# Altium schematic sheet MCU063A_Support.SchDoc
size 431 x 279 mm; Date: Not shown in title block; ApprovedBy: Not shown in title block; CheckedBy: Not shown in title block; Author: Not shown in title block; CompanyName: Not shown in title block; DrawnBy: Cody Watkins; Engineer: Not shown in title block; Organization: Not shown in title block; Address1: Not shown in title block; Address2: Not shown in title block; Address3: Not shown in title block; Address4: Not shown in title block; DocumentNumber: 3; Revision: Use project parameter SCH_Rev; SheetNumber: 3; SheetTotal: 11; PageSetup: Record=PageOptions|CenterHorizontal=True|CenterVertical=True|PrintScale=1.00|XCorrection=1.00|YCorrection=1.00|PrintKind=0|BorderSize=5000000|LeftOffset=0|BottomOffset=0|Orientation=2|PaperLength=1000|PaperWidth=1000|Scale=100|PaperSource=15|PrintQuality=600|MediaType=1|DitherType=10|PaperKind=Letter|PrintScaleMode=1; CurrentTime: Not shown in title block; CurrentDate: Not shown in title block; Time: Not shown in title block; DocumentFullPathAndName: Not shown in title block; DocumentName: Not shown in title block; ModifiedDate: Not shown in title block; ImagePath: Not shown in title block
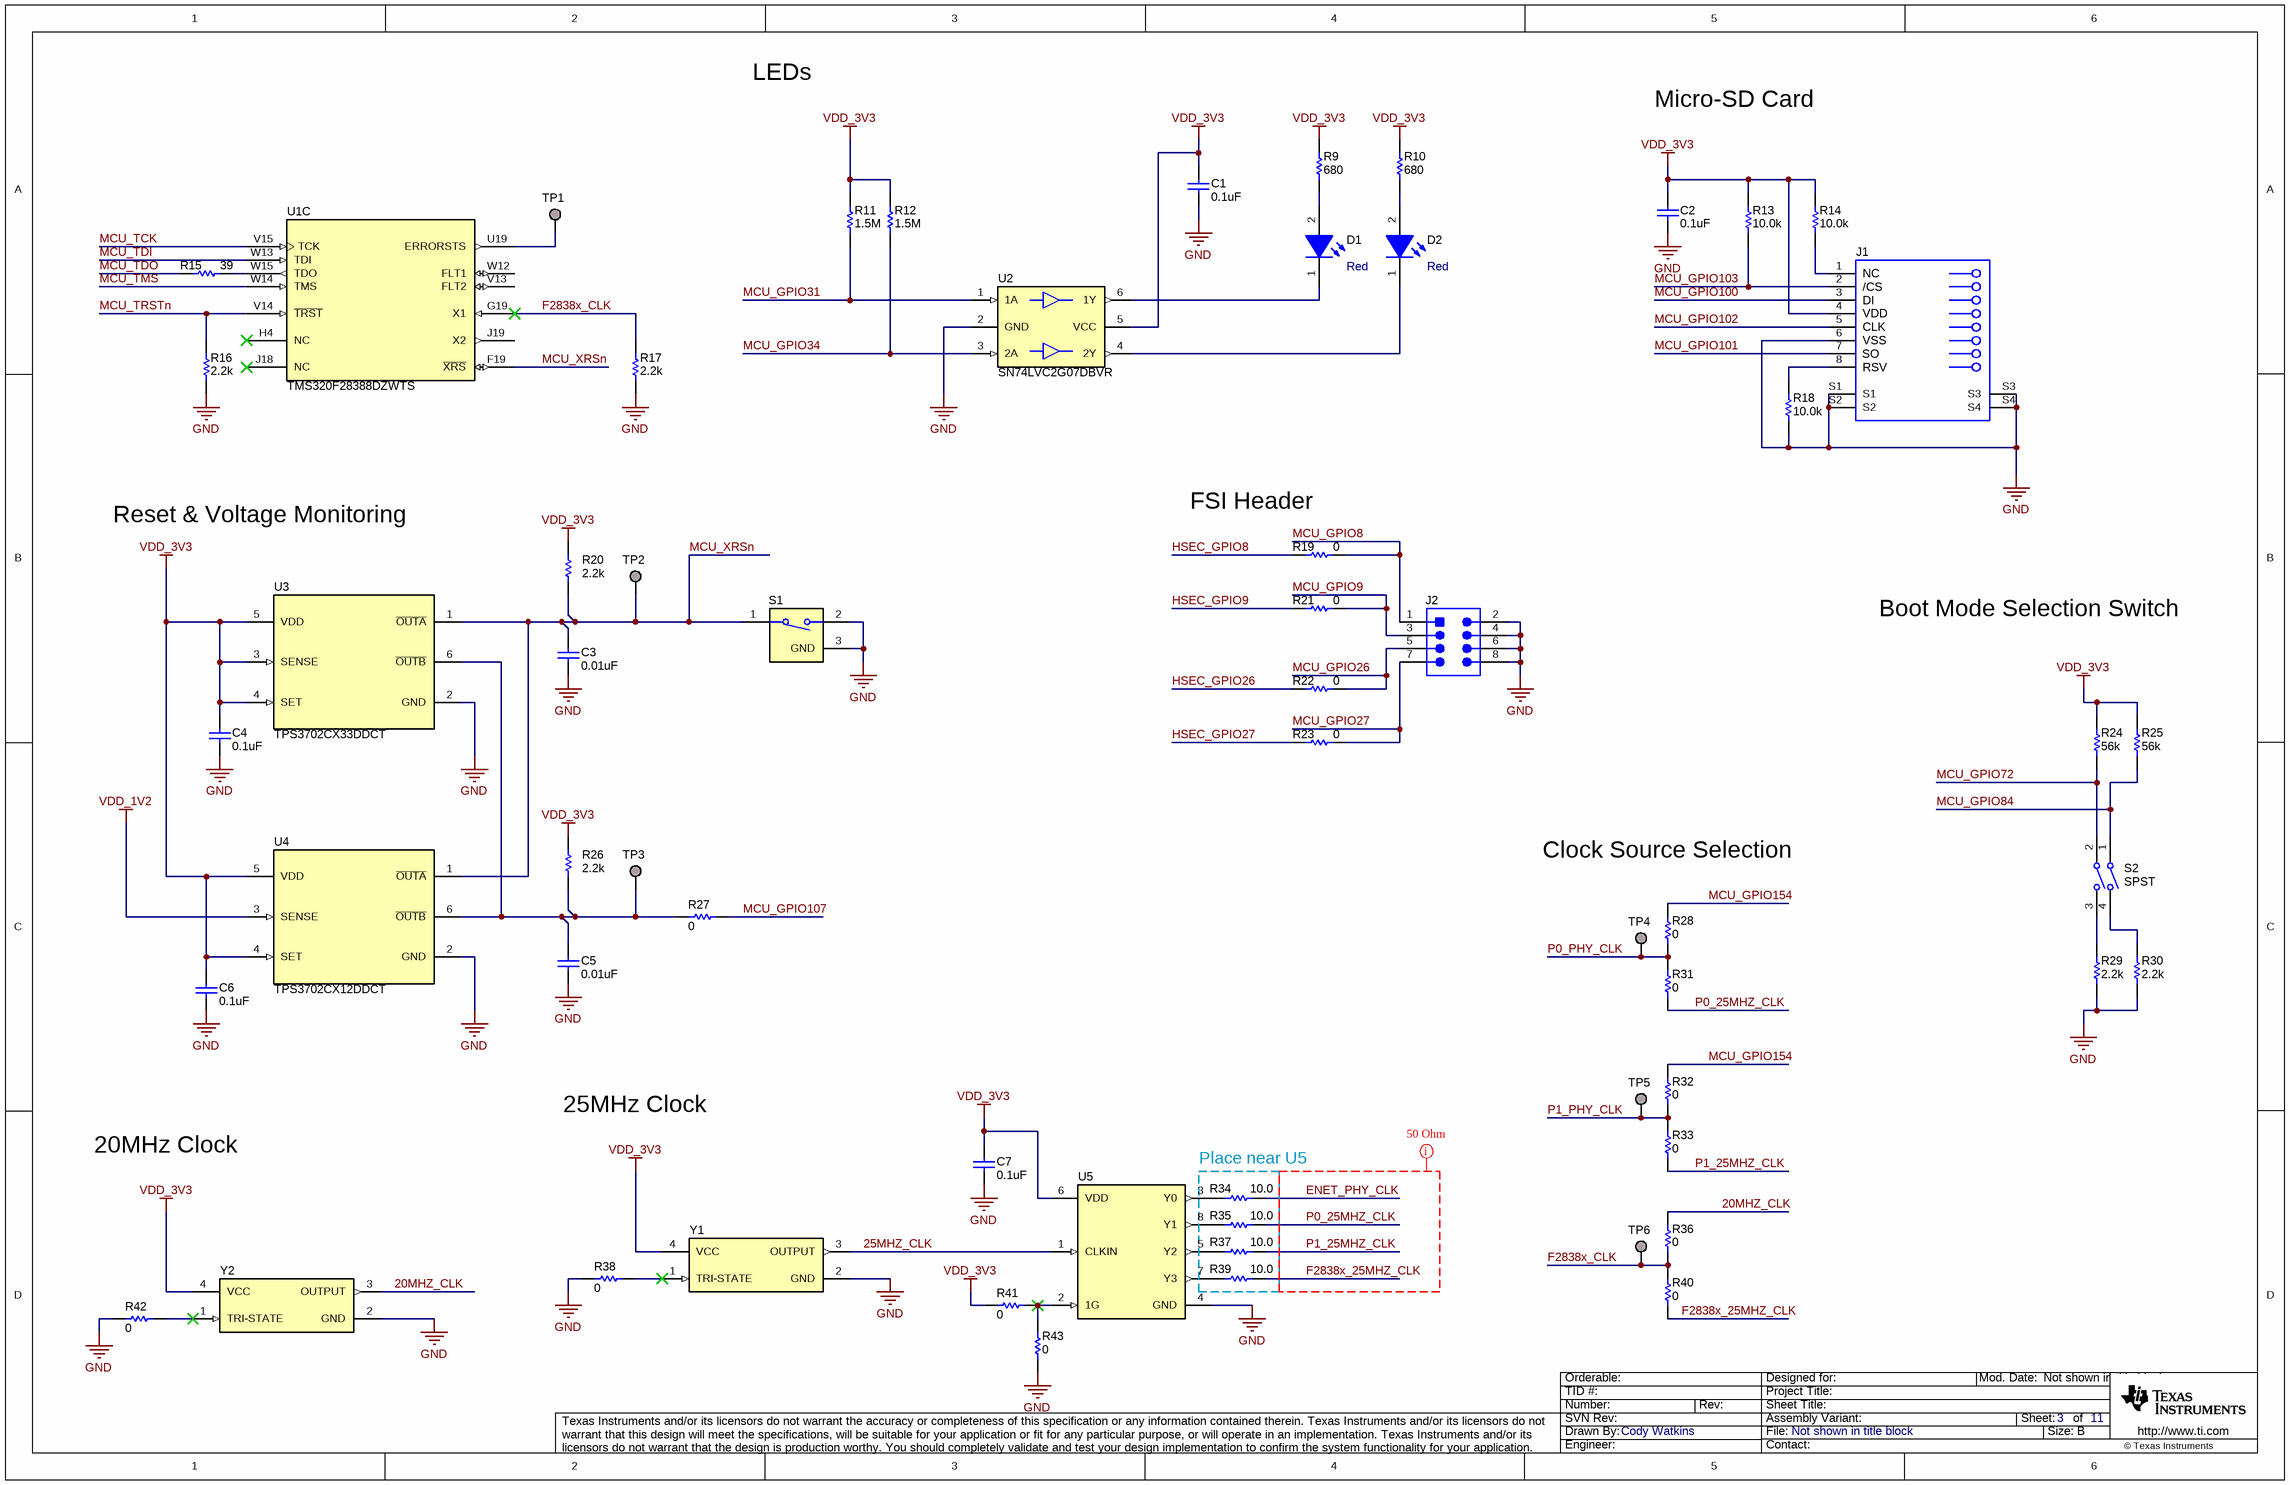
[diagram p0: MCU063A_Support.SchDoc]

## Parts
C1  ValueDisplayed: 0.1uF  [0402]  (hidden comment: CL05B104KP5NNNC)
C2  ValueDisplayed: 0.1uF  [0402]  (hidden comment: CL05B104KP5NNNC)
C3  ValueDisplayed: 0.01uF  [0402]  (hidden comment: C0402C103J5RACTU)
C4  ValueDisplayed: 0.1uF  [0402]  (hidden comment: CL05B104KP5NNNC)
C5  ValueDisplayed: 0.01uF  [0402]  (hidden comment: C0402C103J5RACTU)
C6  ValueDisplayed: 0.1uF  [0402]  (hidden comment: CL05B104KP5NNNC)
C7  ValueDisplayed: 0.1uF  [0402]  (hidden comment: CL05B104KP5NNNC)
D1  value Red  [WL-SMCW_RED_0805]  (hidden comment: 150080SS75000)
D2  value Red  [WL-SMCW_RED_0805]  (hidden comment: 150080SS75000)
J1  2908-05WB-MG  [3M_2908-05WB-MG]  (value not drawn)
J2  TMM-104-01-T-D  [Samtec_TMM-104-01-x-D]  (value not drawn)
R9  ValueDisplayed: 680  [0402]  (hidden comment: CRCW0402680RJNED)
R10  ValueDisplayed: 680  [0402]  (hidden comment: CRCW0402680RJNED)
R11  ValueDisplayed: 1.5M  [0402]  (hidden comment: CRCW04021M50JNED)
R12  ValueDisplayed: 1.5M  [0402]  (hidden comment: CRCW04021M50JNED)
R13  ValueDisplayed: 10.0k  [0402]  (hidden comment: RC0402FR-0710KL)
R14  ValueDisplayed: 10.0k  [0402]  (hidden comment: RC0402FR-0710KL)
R15  ValueDisplayed: 39  [0402]  (hidden comment: CRCW040239R0JNED)
R16  ValueDisplayed: 2.2k  [0402]  (hidden comment: CRCW04022K20JNED)
R17  ValueDisplayed: 2.2k  [0402]  (hidden comment: CRCW04022K20JNED)
R18  ValueDisplayed: 10.0k  [0402]  (hidden comment: RC0402FR-0710KL)
R19  ValueDisplayed: 0  [0603]  (hidden comment: CRCW06030000Z0EA)
R20  ValueDisplayed: 2.2k  [0402]  (hidden comment: CRCW04022K20JNED)
R21  ValueDisplayed: 0  [0603]  (hidden comment: CRCW06030000Z0EA)
R22  ValueDisplayed: 0  [0603]  (hidden comment: CRCW06030000Z0EA)
R23  ValueDisplayed: 0  [0603]  (hidden comment: CRCW06030000Z0EA)
R24  ValueDisplayed: 56k  [0402]  (hidden comment: CRCW040256K0JNED)
R25  ValueDisplayed: 56k  [0402]  (hidden comment: CRCW040256K0JNED)
R26  ValueDisplayed: 2.2k  [0402]  (hidden comment: CRCW04022K20JNED)
R27  ValueDisplayed: 0  [0603]  (hidden comment: CRCW06030000Z0EA)
R28  ValueDisplayed: 0  [0603]  (hidden comment: CRCW06030000Z0EA)
R29  ValueDisplayed: 2.2k  [0402]  (hidden comment: CRCW04022K20JNED)
R30  ValueDisplayed: 2.2k  [0402]  (hidden comment: CRCW04022K20JNED)
R31  ValueDisplayed: 0  [0603]  (hidden comment: CRCW06030000Z0EA)
R32  ValueDisplayed: 0  [0603]  (hidden comment: CRCW06030000Z0EA)
R33  ValueDisplayed: 0  [0603]  (hidden comment: CRCW06030000Z0EA)
R34  ValueDisplayed: 10.0  [CPF0402]  (hidden comment: CPF0402B10RE1)
R35  ValueDisplayed: 10.0  [CPF0402]  (hidden comment: CPF0402B10RE1)
R36  ValueDisplayed: 0  [0603]  (hidden comment: CRCW06030000Z0EA)
R37  ValueDisplayed: 10.0  [CPF0402]  (hidden comment: CPF0402B10RE1)
R38  ValueDisplayed: 0  [0402]  (hidden comment: CRCW04020000Z0EDHP)
R39  ValueDisplayed: 10.0  [CPF0402]  (hidden comment: CPF0402B10RE1)
R40  ValueDisplayed: 0  [0603]  (hidden comment: CRCW06030000Z0EA)
R41  ValueDisplayed: 0  [0402]  (hidden comment: CRCW04020000Z0EDHP)
R42  ValueDisplayed: 0  [0402]  (hidden comment: CRCW04020000Z0EDHP)
R43  ValueDisplayed: 0  [0402]  (hidden comment: CRCW04020000Z0EDHP)
S1  B3U-1100P  [SW_B3U-1100P]  (value not drawn)
S2  Circuit: SPST  [SW_218-2LP]  (hidden comment: 218-2LPST)
TP1  TESTPOINT  [TP_50MIL-25MILHOLE]  (value not drawn)  (no BOM)
TP2  TESTPOINT  [TP_50MIL-25MILHOLE]  (value not drawn)  (no BOM)
TP3  TESTPOINT  [TP_50MIL-25MILHOLE]  (value not drawn)  (no BOM)
TP4  TESTPOINT  [TP_50MIL-25MILHOLE]  (value not drawn)  (no BOM)
TP5  TESTPOINT  [TP_50MIL-25MILHOLE]  (value not drawn)  (no BOM)
TP6  TESTPOINT  [TP_50MIL-25MILHOLE]  (value not drawn)  (no BOM)
U1  TMS320F28388DZWTS  [ZWT0337A]  (part C of 5)
U2  SN74LVC2G07DBVR  [DBV0006A_N]
U3  TPS3702CX33DDCT  [DDC0006A_N]
U4  TPS3702CX12DDCT  [DDC0006A_N]
U5  CDCLVC1104PW  [PW0008A_N]  (value not drawn)
Y1  ECS-2520S33-250-FN-TR  [ECS_ECS-2520S]  (value not drawn)
Y2  ECS-2520S33-200-FN-TR  [ECS_ECS-2520S]  (value not drawn)

## Nets
GND: C1.2 C2.2 C3.2 C4.2 C5.2 C6.2 C7.2 J1.6(VSS) J1.S1 J1.S2 J1.S3 J1.S4 J2.2 J2.4 J2.6 J2.8 R16.1 R17.1 R18.1 R29.2 R30.1 R38.2 R42.2 R43.2 S1.2 S1.3(GND) U2.2(GND) U3.2(GND) U4.2(GND) U5.4(GND) Y1.2(GND) Y2.2(GND)
VDD_1V2: U4.3(SENSE)
VDD_3V3: C1.1 C2.1 C4.1 C6.1 C7.1 J1.4(VDD) R9.1 R10.1 R11.2 R12.2 R13.2 R14.2 R20.2 R24.1 R25.2 R26.2 R41.1 U2.5(VCC) U3.3(SENSE) U3.4(SET) U3.5(VDD) U4.4(SET) U4.5(VDD) U5.6(VDD) Y1.4(VCC) Y2.4(VCC)
20MHZ_CLK: R36.1 Y2.3(OUTPUT)
25MHZ_CLK: U5.1(CLKIN) Y1.3(OUTPUT)
ENET_PHY_CLK: R34.2
F2838x_25MHZ_CLK: R39.2 R40.2
F2838x_CLK: R17.2 R36.2 R40.1 TP6.1 U1.G19(X1)
HSEC_GPIO8: R19.2
HSEC_GPIO9: R21.2
HSEC_GPIO26: R22.2
HSEC_GPIO27: R23.2
MCU_GPIO8: J2.1 R19.1
MCU_GPIO9: J2.3 R21.1
MCU_GPIO26: J2.5 R22.1
MCU_GPIO27: J2.7 R23.1
MCU_GPIO31: R11.1 U2.1(1A)
MCU_GPIO34: R12.1 U2.3(2A)
MCU_GPIO72: R24.2 S2.2
MCU_GPIO84: R25.1 S2.1
MCU_GPIO100: J1.3(CMD)
MCU_GPIO101: J1.7(DAT0)
MCU_GPIO102: J1.5(CLK)
MCU_GPIO103: J1.2(CD/DAT3) R13.1
MCU_GPIO107: R27.2
MCU_GPIO154: R28.1 R32.1
MCU_TCK: U1.V15(TCK)
MCU_TDI: U1.W13(TDI)
MCU_TDO: R15.1
MCU_TMS: U1.W14(TMS)
MCU_TRSTn: R16.2 U1.V14(~{TRST})
MCU_XRSn: C3.1 R20.1 S1.1 TP2.1 U1.F19(~{XRS}) U3.1(~{OUTA}) U4.1(~{OUTA})
P0_25MHZ_CLK: R31.2 R35.2
P0_PHY_CLK: R28.2 R31.1 TP4.1
P1_25MHZ_CLK: R33.2 R37.2
P1_PHY_CLK: R32.2 R33.1 TP5.1
NetC5_1: C5.1 R26.1 R27.1 TP3.1 U3.6(~{OUTB}) U4.6(~{OUTB})
NetD1_1: D1.1(K) U2.6(1Y)
NetD1_2: D1.2(A) R9.2
NetD2_1: D2.1(K) U2.4(2Y)
NetD2_2: D2.2(A) R10.2
NetJ1_1: J1.1(DAT2) R14.1
NetJ1_8: J1.8(DAT1) R18.2
NetR15_2: R15.2 U1.W15(TDO)
NetR29_1: R29.1 S2.3
NetR30_2: R30.2 S2.4
NetR34_1: R34.1 U5.3(Y0)
NetR35_1: R35.1 U5.8(Y1)
NetR37_1: R37.1 U5.5(Y2)
NetR38_1: R38.1 Y1.1(TRI-STATE)
NetR39_1: R39.1 U5.7(Y3)
NetR41_2: R41.2 R43.1 U5.2(1G)
NetR42_1: R42.1 Y2.1(TRI-STATE)
NetTP1_1: TP1.1 U1.U19(ERRORSTS)

Not connected (* = marked no-connect by the designer): U1 H4(NC)* J18(NC)* J19(X2) V13(FLT2) W12(FLT1)

## Layout directives
50 Ohm Impedance: Undefined: ENET_PHY_CLK, F2838x_25MHZ_CLK, P0_25MHZ_CLK, P1_25MHZ_CLK

## Notes on the sheet
- LEDs
- Micro-SD Card
- (near R19) FSI Header
- Reset & Voltage Monitoring
- Boot Mode Selection Switch
- Clock Source Selection
- 25MHz Clock
- 20MHz Clock
- Place near U5
- Drawn By:
- SVN Rev:
- Number:
- TID #:
- Orderable:
- Rev:
- Sheet Title:
- File:
- Project Title:
- Designed for:
- Assembly Variant:
- Mod. Date:
- Sheet:
- Size:
- of
- B
- http://www.ti.com
- Texas Instruments and/or its licensors do not warrant the accuracy or completeness of this specification or any information contained therein. Texas Instruments and/or its licensors do not warrant that this design will meet the specifications, will be suitable for your application or fit for any particular purpose, or will operate in an implementation. Texas Instruments and/or its licensors do not warrant that the design is production worthy. You should completely validate and test your design implementation to confirm the system functionality for your application.
- Engineer:
- Contact:
- © Texas Instruments
- (in symbol CMP-0075148-2) NC; /CS; DI; SO; RSV

## Library data of the parts
C1 C2 C4 C6 C7 = CMP-0006343-2: CAP, CERM, 0.1 uF, 10 V, +/- 10%, X7R, 0402; Manufacturer: Samsung Electro-Mechanics; Polarized: N; Value: 0.1uF; U/M: EA; Cap_F: 100nF; Value1: Unknown; VDC_V: 10V; TaMin_C: -55°C; TaMax_C: 125°C; AEC Category: Q200; SizeArea_mm2: 0.5; SizeAreaWB_mm2: 3; SizeX_mm: 1; SizeZ_mm: 0.6; CompType: Capacitor; PartNumber: CL05B104KP5NNNC; PackageReference: 0402; RoHS: Y; Tolerance_%: 10%; Value2: 10V; MountType: SMT; Technology: Ceramic; TempCo: X7R; Cap_Case: 0402; Published: 2008-06-19; Publisher: Texas Instruments; LatestRevisionDate: 2017-03-09; ComponentLink1Description: Datasheet link; ComponentLink1URL: http://www.samsungsem.com/kr/front/downloadcms.do?path=/kr/support/product-search/mlcc/__icsFiles/afieldfile/2014/11/05&fileName=S_CL05B104KP5NNNC.pdf; AEC Qualified: N; AEC Grade: N/A; SizeY_mm: 0.5
C3 C5 = CMP-0006236-2: CAP, CERM, 0.01 uF, 50 V, +/- 5%, X7R, 0402; Manufacturer: Kemet; TaMin_C: -55°C; Polarized: N; SizeAreaWB_mm2: 3; Value1: Unknown; U/M: EA; Value: 0.01uF; TaMax_C: 125°C; SizeZ_mm: 0.6; SizeX_mm: 1; SizeY_mm: 0.5; Value2: 50V; Cap_F: 10nF; AEC Category: Q200; Supplier Part Number 2: 57J0044; Publisher: Texas Instruments; Supplier 2: Newark; Supplier Part Number 3: 80-C0402C103J5R; TempCo: X7R; Supplier 3: Mouser; Published: 2008-06-19; RoHS: Y; MountType: SMT; Supplier 1: Digi-Key; PackageReference: 0402; Tolerance_%: 5%; Cap_Case: 0402; SizeArea_mm2: 0.5; CompType: Capacitor; LatestRevisionDate: 2017-03-09; PartNumber: C0402C103J5RACTU; AEC Qualified: ?; ComponentLink1Description: Datasheet link; Supplier Part Number 1: 399-7758-1-ND; Technology: Ceramic; ComponentLink1URL: http://www.kemet.com/Lists/ProductCatalog/Attachments/53/KEM_C1002_X7R_SMD.pdf
D1 = CMP-0002951-3: LED, Red, SMD; Manufacturer: Wurth Elektronik; Type: AlInGaP; Angle: 140; Vr_V: 5V; Ir_A: 25µA; Vf_V: 1.9V; Value1: 0.072W; Tjmax_C: 85°C; Io_A: 30mA; Power_TotalModule: 72mW; CompType: LED; PartNumber: 150080SS75000; Color: Red; MountType: SMT; ComponentLink1URL: http://katalog.we-online.de/led/datasheet/150080SS75000.pdf; PackageReference: LED_0805; ComponentLink1Description: Datasheet link; Value2: 1.9V; RoHS: Y
D2 = CMP-0002951-3: LED, Red, SMD; Manufacturer: Wurth Elektronik; Type: AlInGaP; Vf_V: 1.9V; Io_A: 30mA; Vr_V: 5V; Ir_A: 25µA; Tjmax_C: 85°C; Power_TotalModule: 72mW; Value1: 0.072W; Angle: 140; PartNumber: 150080SS75000; PackageReference: LED_0805; RoHS: Y; CompType: LED; MountType: SMT; Value2: 1.9V; Color: Red; ComponentLink1URL: http://katalog.we-online.de/led/datasheet/150080SS75000.pdf; ComponentLink1Description: Datasheet link
J1 = CMP-0075148-2: Connector, Micro SD, R/A, SMD; Manufacturer: 3M; Gender: Female; Row_Count: 1; Pitch_mm: 1.1; ContactFinish: Gold; ComponentLink1URL: http://multimedia.3m.com/mws/media/416257O/3mtm-card-connector-microsdtm-2900-series-ts2197.pdf?&a4x&cEVuQEcuZgVs6EVs6E666666--; Supplier Part Number 2: 28M0115; Supplier 2: Newark; Supplier Part Number 3: 517-2908-05WB-MG; Supplier 3: Mouser; RoHS: Y; MountType: SMT; Supplier 1: Digi-Key; PackageReference: Connector, Micro SD, R/A, SMD; PinCount: 8; CompType: Connector; PartNumber: 2908-05WB-MG; Orientation: R/A; ComponentLink1Description: Datasheet URL; Supplier Part Number 1: 3M5607CT-ND
J2 = CMP-0055568-2: Header, 2mm, 4x2, Tin, TH; Manufacturer: Samtec; Current_A: 3.2A; Shrouded: N; Gender: Male; Cert_CSA: Y; Row_Count: 2; ComponentLink1URL: http://suddendocs.samtec.com/catalog_english/tmm_th.pdf; ClassName: Header; Supplier Part Number 2: 12P0661; Supplier 2: Newark; Supplier Part Number 3: 1803386; Color: Black; Supplier 3: Farnell; RoHS: Y; MountType: TH; Supplier 1: Digi-Key; PackageReference: Header, 2mm, 4x2, TH; PinCount: 8; CompType: Header; PartNumber: TMM-104-01-T-D; Orientation: Vertical; RowSpacing_mm: 2; ComponentLink1Description: Datasheet URL; Supplier Part Number 1: SAM1177-04-ND; Pitch_mm: 2; ContactFinish: Tin; Cert_UL: Y
R9 R10 = CMP-0026962-3: RES, 680, 5%, 0.063 W, AEC-Q200 Grade 0, 0402; Manufacturer: Vishay-Dale; Value: 680; Value_Code: 680R; Power_W: 63mW; Value2: 0.063W; VDC_V: 50V; TempCo: 200 ppm/C; EIA_Code: E24; AEC Category: Q200; AEC Qualified: Y; AEC Grade: 0; SizeArea_mm2: 0.5; SizeX_mm: 1; SizeZ_mm: 0.6; CompType: Resistor; PartNumber: CRCW0402680RJNED; PackageReference: 0402; RoHS: E; Res_ohm: 680; Tolerance_%: 5%; Value1: 5%; MountType: SMT; Technology: Thick Film; ComponentLink1Description: Datasheet link; ComponentLink1URL: http://www.vishay.com/docs/20035/dcrcwe3.pdf; Supplier 1: Digi-Key; Supplier Part Number 1: 541-680JCT-ND; Supplier 2: Newark; Supplier Part Number 2: 59M6744; Supplier 3: Mouser; Supplier Part Number 3: 71-CRCW0402J-680-E3; SizeY_mm: 0.5
R11 R12 = CMP-0026863-2: RES, 1.5 M, 5%, 0.063 W, AEC-Q200 Grade 0, 0402; Manufacturer: Vishay-Dale; Power_W: 63mW; TempCo: 200 ppm/C; Value_Code: 1M50; Value: 1.5Meg; EIA_Code: E24; SizeX_mm: 1; SizeY_mm: 0.5; SizeZ_mm: 0.6; Value2: 0.063W; AEC Qualified: Y; VDC_V: 50V; AEC Category: Q200; AEC Grade: 0; ComponentLink1URL: http://www.vishay.com/docs/20035/dcrcwe3.pdf; Supplier Part Number 2: 71-CRCW04021M50JNED; Supplier 2: Mouser; RoHS: E; Value1: 5%; MountType: SMT; Supplier 1: Digi-Key; PackageReference: 0402; Tolerance_%: 5%; Res_ohm: 1.5M; SizeArea_mm2: 0.5; CompType: Resistor; PartNumber: CRCW04021M50JNED; ComponentLink1Description: Datasheet link; Supplier Part Number 1: 541-1.5MJCT-ND; Technology: Thick Film
R13 R14 R18 = CMP-0078669-1: RES, 10.0 k, 1%, 0.063 W, 0402; Manufacturer: Yageo America; Power_W: 63mW; Green_Lifecycle: Active; TempCo: 100 ppm/C; Value_Code: 10k0; Green_REACh: Passed; Value: 10.0k; EIA_Code: E96; Res_ohm: 10k; SizeX_mm: 1; SizeY_mm: 0.5; SizeZ_mm: 0.6; Value2: 0.063W; AEC Qualified: N; AEC Category: Q200; ComponentLink1URL: http://www.yageo.com/documents/recent/PYu-RC_Group_51_RoHS_L_8.pdf; Supplier Part Number 2: 98K7499; Supplier 2: Newark; Supplier Part Number 3: 603-RC0402FR-0710KL; Supplier 3: Mouser; RoHS: Y; Value1: 1%; MountType: SMT; Green_EU RoHS-2: Passed; Supplier 1: Digi-Key; Green_EU RoHS: Passed with Exemption; PackageReference: 0402; Tolerance_%: 1%; SizeArea_mm2: 0.5; CompType: Resistor; PartNumber: RC0402FR-0710KL; ComponentLink1Description: Datasheet link; AEC Grade: N/A; Supplier Part Number 1: 311-10.0KLRCT-ND; Technology: Thick Film
R15 = CMP-0026916-3: RES, 39, 5%, 0.063 W, AEC-Q200 Grade 0, 0402; Manufacturer: Vishay-Dale; Power_W: 63mW; TempCo: 200 ppm/C; Value_Code: 39R0; Value: 39; EIA_Code: E24; SizeX_mm: 1; SizeY_mm: 0.5; SizeZ_mm: 0.6; Value2: 0.063W; AEC Qualified: Y; VDC_V: 50V; AEC Category: Q200; AEC Grade: 0; Supplier Part Number 2: 89M6649; Supplier 2: Newark; Supplier Part Number 3: 71-CRCW0402J-39-E3; Supplier 3: Mouser; RoHS: E; Value1: 5%; MountType: SMT; Supplier 1: Digi-Key; PackageReference: 0402; Tolerance_%: 5%; Res_ohm: 39; SizeArea_mm2: 0.5; CompType: Resistor; PartNumber: CRCW040239R0JNED; ComponentLink1Description: Datasheet link; Supplier Part Number 1: 541-39JCT-ND; Technology: Thick Film; ComponentLink1URL: http://www.vishay.com/docs/20035/dcrcwe3.pdf
R16 R17 = CMP-0026890-5: RES, 2.2 k, 5%, 0.063 W, AEC-Q200 Grade 0, 0402; Manufacturer: Vishay-Dale; Power_W: 63mW; TempCo: 200 ppm/C; Value_Code: 2k20; Value: 2.2k; EIA_Code: E24; SizeX_mm: 1; SizeY_mm: 0.5; SizeZ_mm: 0.6; Value2: 0.063W; AEC Qualified: Y; VDC_V: 50V; AEC Category: Q200; AEC Grade: 0; Supplier Part Number 2: 59M6710; Supplier 2: Newark; Supplier Part Number 3: 71-CRCW0402J-2.2K-E3; Supplier 3: Mouser; RoHS: E; Value1: 5%; MountType: SMT; Supplier 1: Digi-Key; PackageReference: 0402; Tolerance_%: 5%; Res_ohm: 2.2k; SizeArea_mm2: 0.5; CompType: Resistor; PartNumber: CRCW04022K20JNED; ComponentLink1Description: Datasheet link; Supplier Part Number 1: 541-2.2KJCT-ND; Technology: Thick Film; ComponentLink1URL: http://www.vishay.com/docs/20035/dcrcwe3.pdf
R19 R21-R23 R27 R28 R31-R33 R36 R40 = CMP-0025697-4: RES, 0, 5%, 0.1 W, AEC-Q200 Grade 0, 0603; Manufacturer: Vishay-Dale; Value: 0; Value_Code: 0000; Power_W: 100mW; Value2: 0.1W; VDC_V: 75V; TempCo: 200 ppm/C; EIA_Code: E24; AEC Category: Q200; AEC Qualified: Y; SizeArea_mm2: 1.28; SizeX_mm: 1.6; SizeY_mm: 0.8; SizeZ_mm: 1; CompType: Resistor; PartNumber: CRCW06030000Z0EA; PackageReference: 0603; RoHS: E; Res_ohm: 0; Tolerance_%: 5%; Value1: 5%; MountType: SMT; Technology: Thick Film; ComponentLink1Description: Datasheet link; ComponentLink1URL: http://www.vishay.com/docs/20035/dcrcwe3.pdf; Supplier 1: Digi-Key; Supplier Part Number 1: 541-0.0GCT-ND; Supplier 2: Newark; Supplier Part Number 2: 52K8014; Supplier 3: Mouser; Supplier Part Number 3: 71-CRCW0603-0-E3; AEC Grade: 0
R20 R26 R29 R30 = CMP-0026890-5: RES, 2.2 k, 5%, 0.063 W, AEC-Q200 Grade 0, 0402; Manufacturer: Vishay-Dale; Value: 2.2k; Value_Code: 2k20; Power_W: 63mW; Value2: 0.063W; VDC_V: 50V; TempCo: 200 ppm/C; EIA_Code: E24; AEC Category: Q200; AEC Qualified: Y; AEC Grade: 0; SizeArea_mm2: 0.5; SizeX_mm: 1; SizeZ_mm: 0.6; CompType: Resistor; PartNumber: CRCW04022K20JNED; PackageReference: 0402; RoHS: E; Res_ohm: 2.2k; Tolerance_%: 5%; Value1: 5%; MountType: SMT; Technology: Thick Film; ComponentLink1Description: Datasheet link; ComponentLink1URL: http://www.vishay.com/docs/20035/dcrcwe3.pdf; Supplier 1: Digi-Key; Supplier Part Number 1: 541-2.2KJCT-ND; Supplier 2: Newark; Supplier Part Number 2: 59M6710; Supplier 3: Mouser; Supplier Part Number 3: 71-CRCW0402J-2.2K-E3; SizeY_mm: 0.5
R24 R25 = CMP-0026949-3: RES, 56 k, 5%, 0.063 W, AEC-Q200 Grade 0, 0402; Manufacturer: Vishay-Dale; Value: 56k; Value_Code: 56k0; Power_W: 63mW; Value2: 0.063W; VDC_V: 50V; TempCo: 200 ppm/C; EIA_Code: E24; AEC Category: Q200; AEC Qualified: Y; AEC Grade: 0; SizeArea_mm2: 0.5; SizeX_mm: 1; SizeZ_mm: 0.6; CompType: Resistor; PartNumber: CRCW040256K0JNED; PackageReference: 0402; RoHS: E; Res_ohm: 56k; Tolerance_%: 5%; Value1: 5%; MountType: SMT; Technology: Thick Film; ComponentLink1Description: Datasheet link; ComponentLink1URL: http://www.vishay.com/docs/20035/dcrcwe3.pdf; Supplier 1: Digi-Key; Supplier Part Number 1: 541-56KJCT-ND; Supplier 2: Newark; Supplier Part Number 2: 89M6680; Supplier 3: Mouser; Supplier Part Number 3: 71-CRCW0402J-56K-E3; SizeY_mm: 0.5
R34 R35 R37 R39 = CMP-0026765-1: RES, 10.0, 0.1%, 0.063 W, 0402; Manufacturer: TE Connectivity; Power_W: 63mW; TempCo: 25 ppm/C; Value_Code: 10R0; U/M: EA; Value: 10.0; EIA_Code: E192; Res_ohm: 10; SizeX_mm: 1; SizeY_mm: 0.5; SizeZ_mm: 0.35; Value2: 0.063W; AEC Qualified: N; AEC Category: Q200; ComponentLink1URL: http://www.te.com/commerce/DocumentDelivery/DDEController?Action=srchrtrv&DocNm=1773200&DocType=DS&DocLang=English; Supplier Part Number 2: 80P3855; Publisher: Texas Instruments; Supplier 2: Newark; Supplier Part Number 3: 279-CPF0402B10RE1; Supplier 3: Mouser; Published: 2008-06-26; RoHS: Y; Value1: 0.1%; MountType: SMT; Supplier 1: Digi-Key; PackageReference: 0402; Tolerance_%: 0.1%; SizeArea_mm2: 0.5; CompType: Resistor; LatestRevisionDate: 2017-03-09; PartNumber: CPF0402B10RE1; ComponentLink1Description: Datasheet link; AEC Grade: N/A; Supplier Part Number 1: A102583CT-ND; Technology: Thin Film
R38 R41-R43 = CMP-0081856-1: RES, 0, 0%, 0.2 W, AEC-Q200 Grade 0, 0402; Manufacturer: Vishay-Dale; SizeAreaWB_mm2: 3; SizeArea_mm2: 0.5; AEC Qualified: Y; AEC Category: Q200; Value: 0; SizeZ_mm: 0.6; Power_W: 200mW; VDC_V: 50V; Value2: 0.2W; SizeX_mm: 1; ComponentLink1Description: Datasheet link; RoHS: Y; Supplier Part Number 3: 71-CRCW04020000Z0EDH; Tolerance_%: 0%; Value_Code: 0; Supplier 1: Digi-Key; PackageReference: 0402; Technology: Thick Film; Res_ohm: 0; PartNumber: CRCW04020000Z0EDHP; Supplier Part Number 2: 96Y9050; Supplier 2: Newark; AEC Grade: 0; SizeY_mm: 0.5; ComponentLink1URL: http://www.vishay.com/docs/20043/crcwhpe3.pdf; Value1: 0%; CompType: Resistor; MountType: SMT; Supplier Part Number 1: 541-0.0YBTR-ND; Supplier 3: Mouser
S1 = CMP-0002193-2: Switch, SPST-NO, Off-Mom, 12 V, SMD; Manufacturer: Omron Electronic Components; CurrentRating_mA: 50A; PositionCount: 1; VDC_V: 12V; Supplier 2: Newark; Supplier 3: Mouser; Supplier 1: Digi-Key; Supplier Part Number 1: SW1021CT-ND; Supplier Part Number 2: 39M4619; Supplier Part Number 3: 653-B3U-1100P; PartNumber: B3U-1100P; ComponentLink1Description: Datasheet URL; LatestRevisionDate: 2017-03-09; CompType: Switch; Publisher: Texas Instruments; Circuit: SPST-NO; RoHS: Y; Orientation: Top Actuated; SwitchFunction: Off-Mom; PackageReference: SMD, 3-Leads, Body 3x2.5mm; MountType: SMT; ComponentLink1URL: http://www.omron.com/ecb/products/pdf/en-b3u.pdf
S2 = CMP-0002230-1: Switch, SPST, 2 Pos, 25mA, 24VDC, SMD; Manufacturer: CTS Electrocomponents; VDC_V: 24V; SwitchFunction: Off-On; PositionCount: 2; CurrentRating_mA: 25A; PartNumber: 218-2LPST; MountType: SMT; ComponentLink1Description: Datasheet Link; ComponentLink1URL: http://www.ctscorp.com/components/Datasheets/218.pdf; RoHS: Y; Orientation: Top Actuated; CompType: Switch; PackageReference: 3.71x5.8mm; Publisher: Texas Instruments; LatestRevisionDate: 2017-03-09; Supplier 1: Digi-Key; Supplier Part Number 1: CT2182LPST-ND; Supplier 2: Mouser; Supplier Part Number 2: 774-2182LPST
TP1-TP6 = CMP-0078143-2: TEST POINT.  No entry in BOM.; CompType: Testpoint; PackageReference: N/A; Manufacturer: N/A; PartNumber: N/A; Library Reference: TESTPOINT
U1 = CMP-0081777-3: TMS320F28388DZWTS, ZWT0337A (NFBGA-337); Manufacturer: Texas Instruments; SizeAreaWB_mm2: 324; SizeArea_mm2: 256; AEC Qualified: N; AEC Category: Q200; SizeZ_mm: 1.4; SizeY_mm: 16; CompType: IC; ComponentLink1Description: Datasheet Link; ComponentLink2Description: Product Folder; PackageReference: ZWT0337A; PartNumber: TMS320F28388DZWTS; PackageDescription: NFBGA-337; ComponentLink2URL: http://www.ti.com/product/tms320f28388d; Alternate Manufacturer: Texas Instruments; ComponentLink3URL: http://www.ti.com/product/tms320f28388d/datasheet; ComponentLink1URL: http://www.ti.com/lit/ds/symlink/tms320f28388d.pdf; MountType: SMT; ComponentLink3Description: Online Datasheet; SizeX_mm: 16
U2 = CMP-0051789-2: Dual Buffer/Driver with Open-Drain Output, DBV0006A, LARGE T&R; Manufacturer: Texas Instruments; 3-State Output: No; Bits(#): 2; F @ Nom Voltage(Max)(Mhz): 150; ICC @ Nom Voltage(Max)(mA): 0.01; Input Type: CMOS/TTL; Logic: True; Output Drive (IOL/IOH)(Max)(mA): 32/-32; Output Type: CMOS; Rating: Catalog; Sub-Family: Inverting Buffer/Driver; Technology Family: LVC; tpd @ Nom Voltage(Max)(ns): 8.6,4.4,3.7,2.9; VCC(Max)(V): 5.5; VCC(Min)(V): 1.65; Voltage(Nom)(V): 1.8,2.5,3.3,5; AEC Category: Q200; AEC Qualified: N; CompType: IC; Green_Lifecycle: Active; Green_REACh: Passed; SizeArea_mm2: 8.12; SizeAreaWB_mm2: 14.82; SizeX_mm: 2.8; SizeY_mm: 2.9; SizeZ_mm: 1.45; PackageReference: DBV0006A; DatasheetVersion: SCES308K; Generic Part Number: SN74LVC2G07; Operating Temperature Range(C): -40 to 125; Schmitt Trigger: No; ComponentLink1Description: Datasheet Link; ComponentLink1URL: http://www.ti.com/lit/ds/symlink/sn74lvc2g07.pdf; ComponentLink2Description: Product Folder; ComponentLink2URL: http://www.ti.com/product/sn74lvc2g07; ComponentLink3Description: Online Datasheet; ComponentLink3URL: http://www.ti.com/product/sn74lvc2g07/datasheet; Green_EU RoHS-2: Passed; Green_EU RoHS: Passed; MountType: SMT; PackageDescription: SOT-23-6; PartNumber: SN74LVC2G07DBVR; RoHS: Y
U3 = CMP-0080903-1: High-Accuracy, Fixed-Threshold OV/UV Monitor, DDC0006A (SOT-23-T-6); Alternate PartNumber: TPS3702CX33DDCR; Alternate Manufacturer: Texas Instruments; SizeAreaWB_mm2: 10.4675; SizeZ_mm: 0.87; SizeX_mm: 1.65; SizeY_mm: 2.95; SizeArea_mm2: 4.8675; CompType: IC; AEC Qualified: N; AEC Category: Q200; ComponentLink1URL: http://www.ti.com/lit/ds/symlink/tps3702.pdf; PackageDescription: SOT-23-T-6; RoHS: Y; MountType: SMT; ComponentLink2URL: http://www.ti.com/product/tps3702; ComponentLink3Description: Online Datasheet; ComponentLink2Description: Product Folder; Manufacturer: Texas Instruments; ComponentLink3URL: http://www.ti.com/product/tps3702/datasheet; PackageReference: DDC0006A; PartNumber: TPS3702CX33DDCT; ComponentLink1Description: Datasheet Link
U4 = CMP-0080906-1: High-Accuracy, Fixed-Threshold OV/UV Monitor, DDC0006A (SOT-23-T-6); Alternate PartNumber: TPS3702CX12DDCR; Alternate Manufacturer: Texas Instruments; SizeAreaWB_mm2: 10.4675; SizeZ_mm: 0.87; SizeX_mm: 1.65; SizeY_mm: 2.95; SizeArea_mm2: 4.8675; CompType: IC; AEC Qualified: N; AEC Category: Q200; ComponentLink1URL: http://www.ti.com/lit/ds/symlink/tps3702.pdf; PackageDescription: SOT-23-T-6; RoHS: Y; MountType: SMT; ComponentLink2URL: http://www.ti.com/product/tps3702; ComponentLink3Description: Online Datasheet; ComponentLink2Description: Product Folder; Manufacturer: Texas Instruments; ComponentLink3URL: http://www.ti.com/product/tps3702/datasheet; PackageReference: DDC0006A; PartNumber: TPS3702CX12DDCT; ComponentLink1Description: Datasheet Link
U5 = CMP-0065661-1: Low Jitter, 1:4 LVCMOS Fan-out Clock Buffer, PW0008A (TSSOP-8); Alternate Manufacturer: Texas Instruments; Green_Lifecycle: Active; SizeAreaWB_mm2: 42.0; Green_REACh: Passed; U/M: EA; SizeZ_mm: 1.2; SizeX_mm: 6.4; SizeY_mm: 3.0; SizeArea_mm2: 19.2; CompType: IC; ComponentLink1URL: http://www.ti.com/lit/ds/symlink/cdclvc1104.pdf; Publisher: Texas Instruments; PackageDescription: TSSOP-8; RoHS: Y; Footprint Path 6: C:\AltiumLibraries\Footprints\TI\.PcbLib; MountType: SMT; Green_EU RoHS-2: Passed; Manufacturer: Texas Instruments; Green_EU RoHS: Passed; PackageReference: PW0008A; LatestRevisionDate: 2017-06-09; PartNumber: CDCLVC1104PW; ComponentLink1Description: Datasheet Link
Y1 = CMP-0082061-1: Oscillator, 25 MHz, 15 pF, SMD; Manufacturer: ECS Inc.; Frequency Stability: 10 ppm; SizeAreaWB_mm2: 10.5; SizeArea_mm2: 5; AEC Qualified: N; AEC Category: Q200; TaMax_C: 85°C; SizeZ_mm: 1; Frequency_Fixed: 25MHz; TaMin_C: -40°C; SizeY_mm: 2.5; Load Capacitance: 15 pF; SizeX_mm: 2; ComponentLink1Description: Datasheet Link; RoHS: Y; Supplier 1: Digi-Key; PackageReference: 2x2.5mm; PartNumber: ECS-2520S33-250-FN-TR; Supplier Part Number 2: 520-2520S33-250-FNT; Supplier 2: Mouser; AEC Grade: N/A; ComponentLink1URL: https://www.ecsxtal.com/store/pdf/ECS-2520S.pdf; CompType: Oscillator; Supplier Part Number 1: XC2198CT-ND; MountType: SMT
Y2 = CMP-0082062-1: Oscillator, 20 MHz, 15 pF, SMD; Manufacturer: ECS Inc.; Frequency Stability: 10 ppm; SizeAreaWB_mm2: 10.5; SizeArea_mm2: 5; AEC Qualified: N; AEC Category: Q200; TaMax_C: 85°C; SizeZ_mm: 1; Frequency_Fixed: 20MHz; TaMin_C: -40°C; SizeY_mm: 2.5; Load Capacitance: 15 pF; SizeX_mm: 2; ComponentLink1Description: Datasheet Link; RoHS: Y; Supplier 1: Digi-Key; PackageReference: 2x2.5mm; PartNumber: ECS-2520S33-200-FN-TR; Supplier Part Number 2: 520-2520S33-200-FNT; Supplier 2: Mouser; AEC Grade: N/A; ComponentLink1URL: https://www.ecsxtal.com/store/pdf/ECS-2520S.pdf; CompType: Oscillator; Supplier Part Number 1: XC2196CT-ND; MountType: SMT